# Altium schematic sheet Revision.SchDoc
size 297 x 209 mm
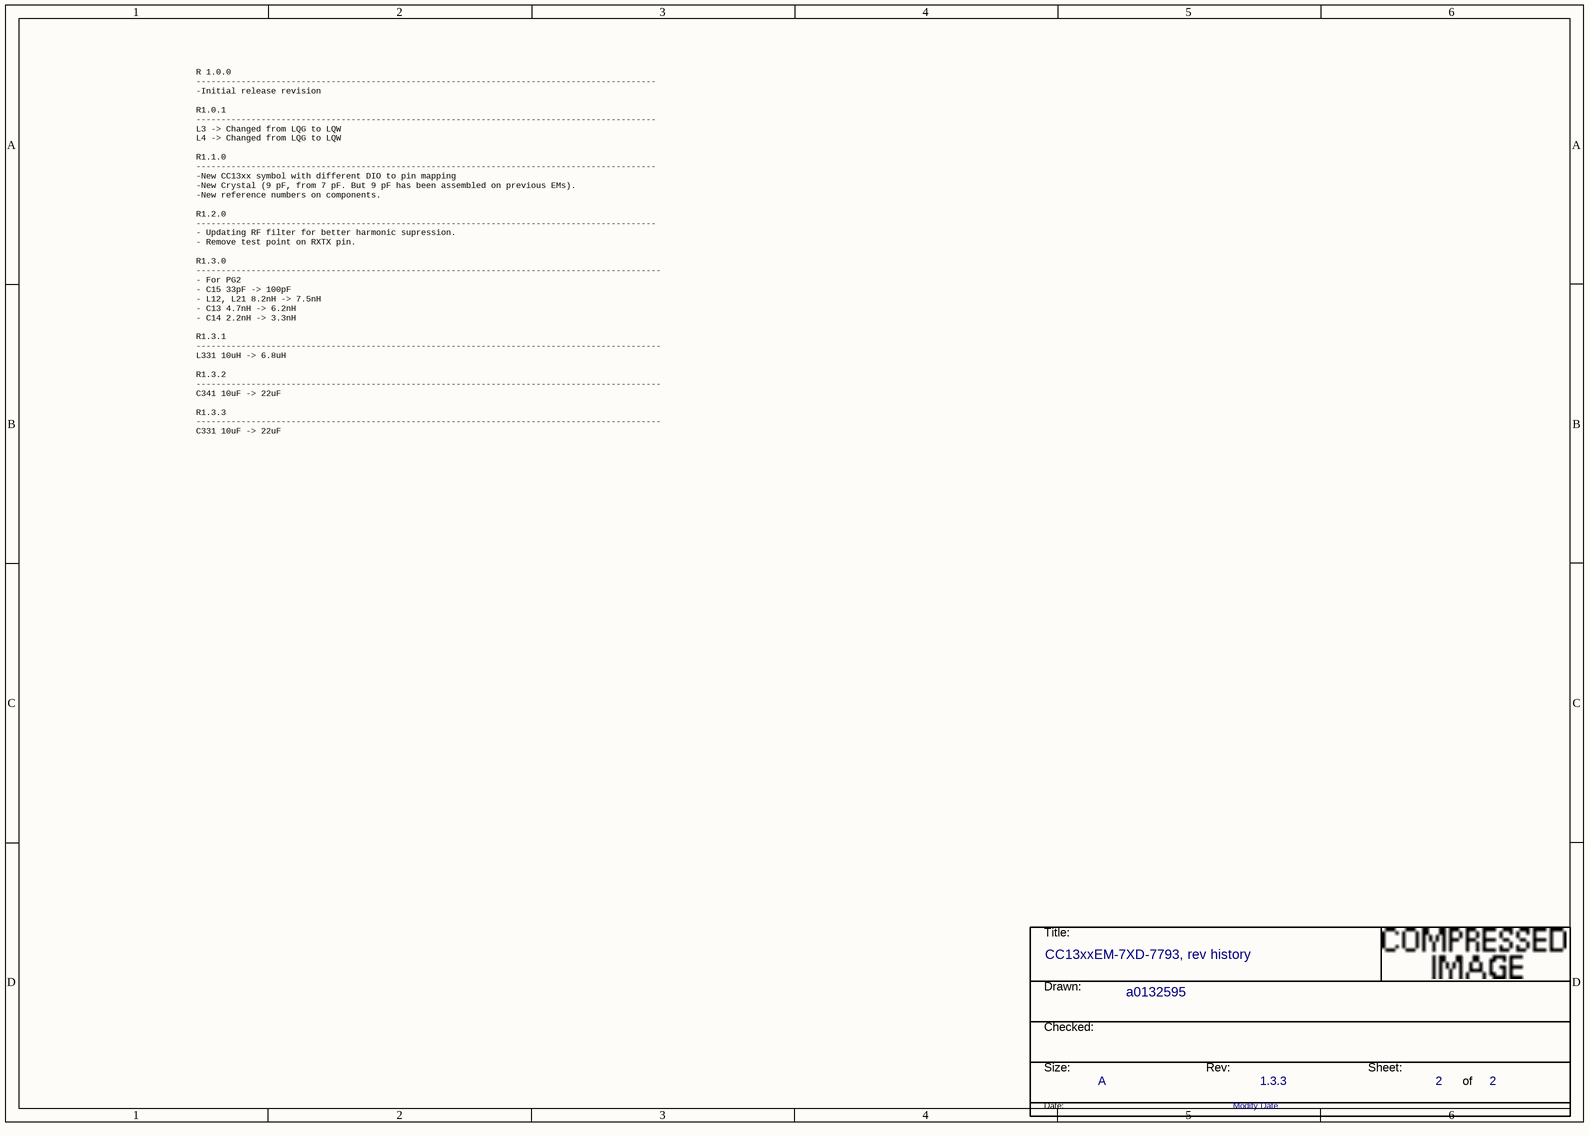
[diagram p0: Revision.SchDoc]

## Parts
*  Title: CC13xxEM-7XD-7793, rev history  Page Number: 2  RevCode: 1.3.3  Page Size: A  Design Modify Date: Modify Date  Designer name: a0132595  (hidden comment: TI_Norway_Title_Block)  (graphical)

## Notes on the sheet
- R 1.0.0
  --------------------------------------------------------------------------------------------
  -Initial release revision
  R1.0.1
  --------------------------------------------------------------------------------------------
  L3 -> Changed from LQG to LQW
  L4 -> Changed from LQG to LQW
  R1.1.0
  --------------------------------------------------------------------------------------------
  -New CC13xx symbol with different DIO to pin mapping
  -New Crystal (9 pF, from 7 pF. But 9 pF has been assembled on previous EMs).
  -New reference numbers on components.
  R1.2.0
  --------------------------------------------------------------------------------------------
  - Updating RF filter for better harmonic supression.
  - Remove test point on RXTX pin.
  R1.3.0
  ---------------------------------------------------------------------------------------------
  - For PG2
  - C15 33pF -> 100pF
  - L12, L21 8.2nH -> 7.5nH
  - C13 4.7nH -> 6.2nH
  - C14 2.2nH -> 3.3nH
  R1.3.1
  ---------------------------------------------------------------------------------------------
  L331 10uH -> 6.8uH
  R1.3.2
  ---------------------------------------------------------------------------------------------
  C341 10uF -> 22uF
  R1.3.3
  ---------------------------------------------------------------------------------------------
  C331 10uF -> 22uF
- (in symbol TI_Norway_Title_Block) Title:; Drawn:; Checked:; Size:; Rev:; Sheet:; of; Date:

## Library data of the parts
* = TI_Norway_Title_Block: Page Count: 2